# EAGLE schematic parte de carga (EAGLE 9.6.2)
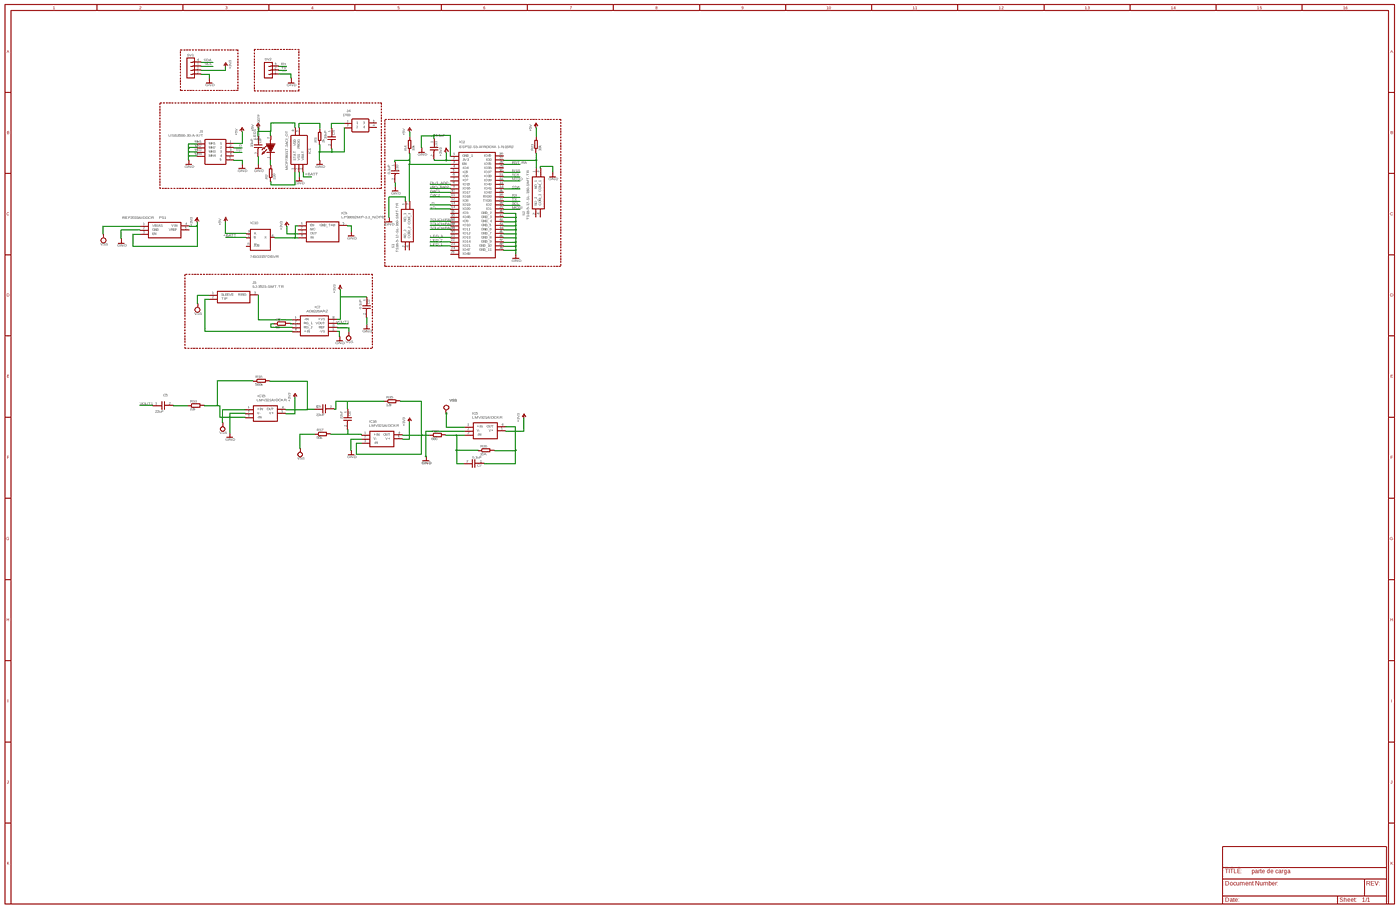
[diagram p0: schematic, sheet 1, overview]
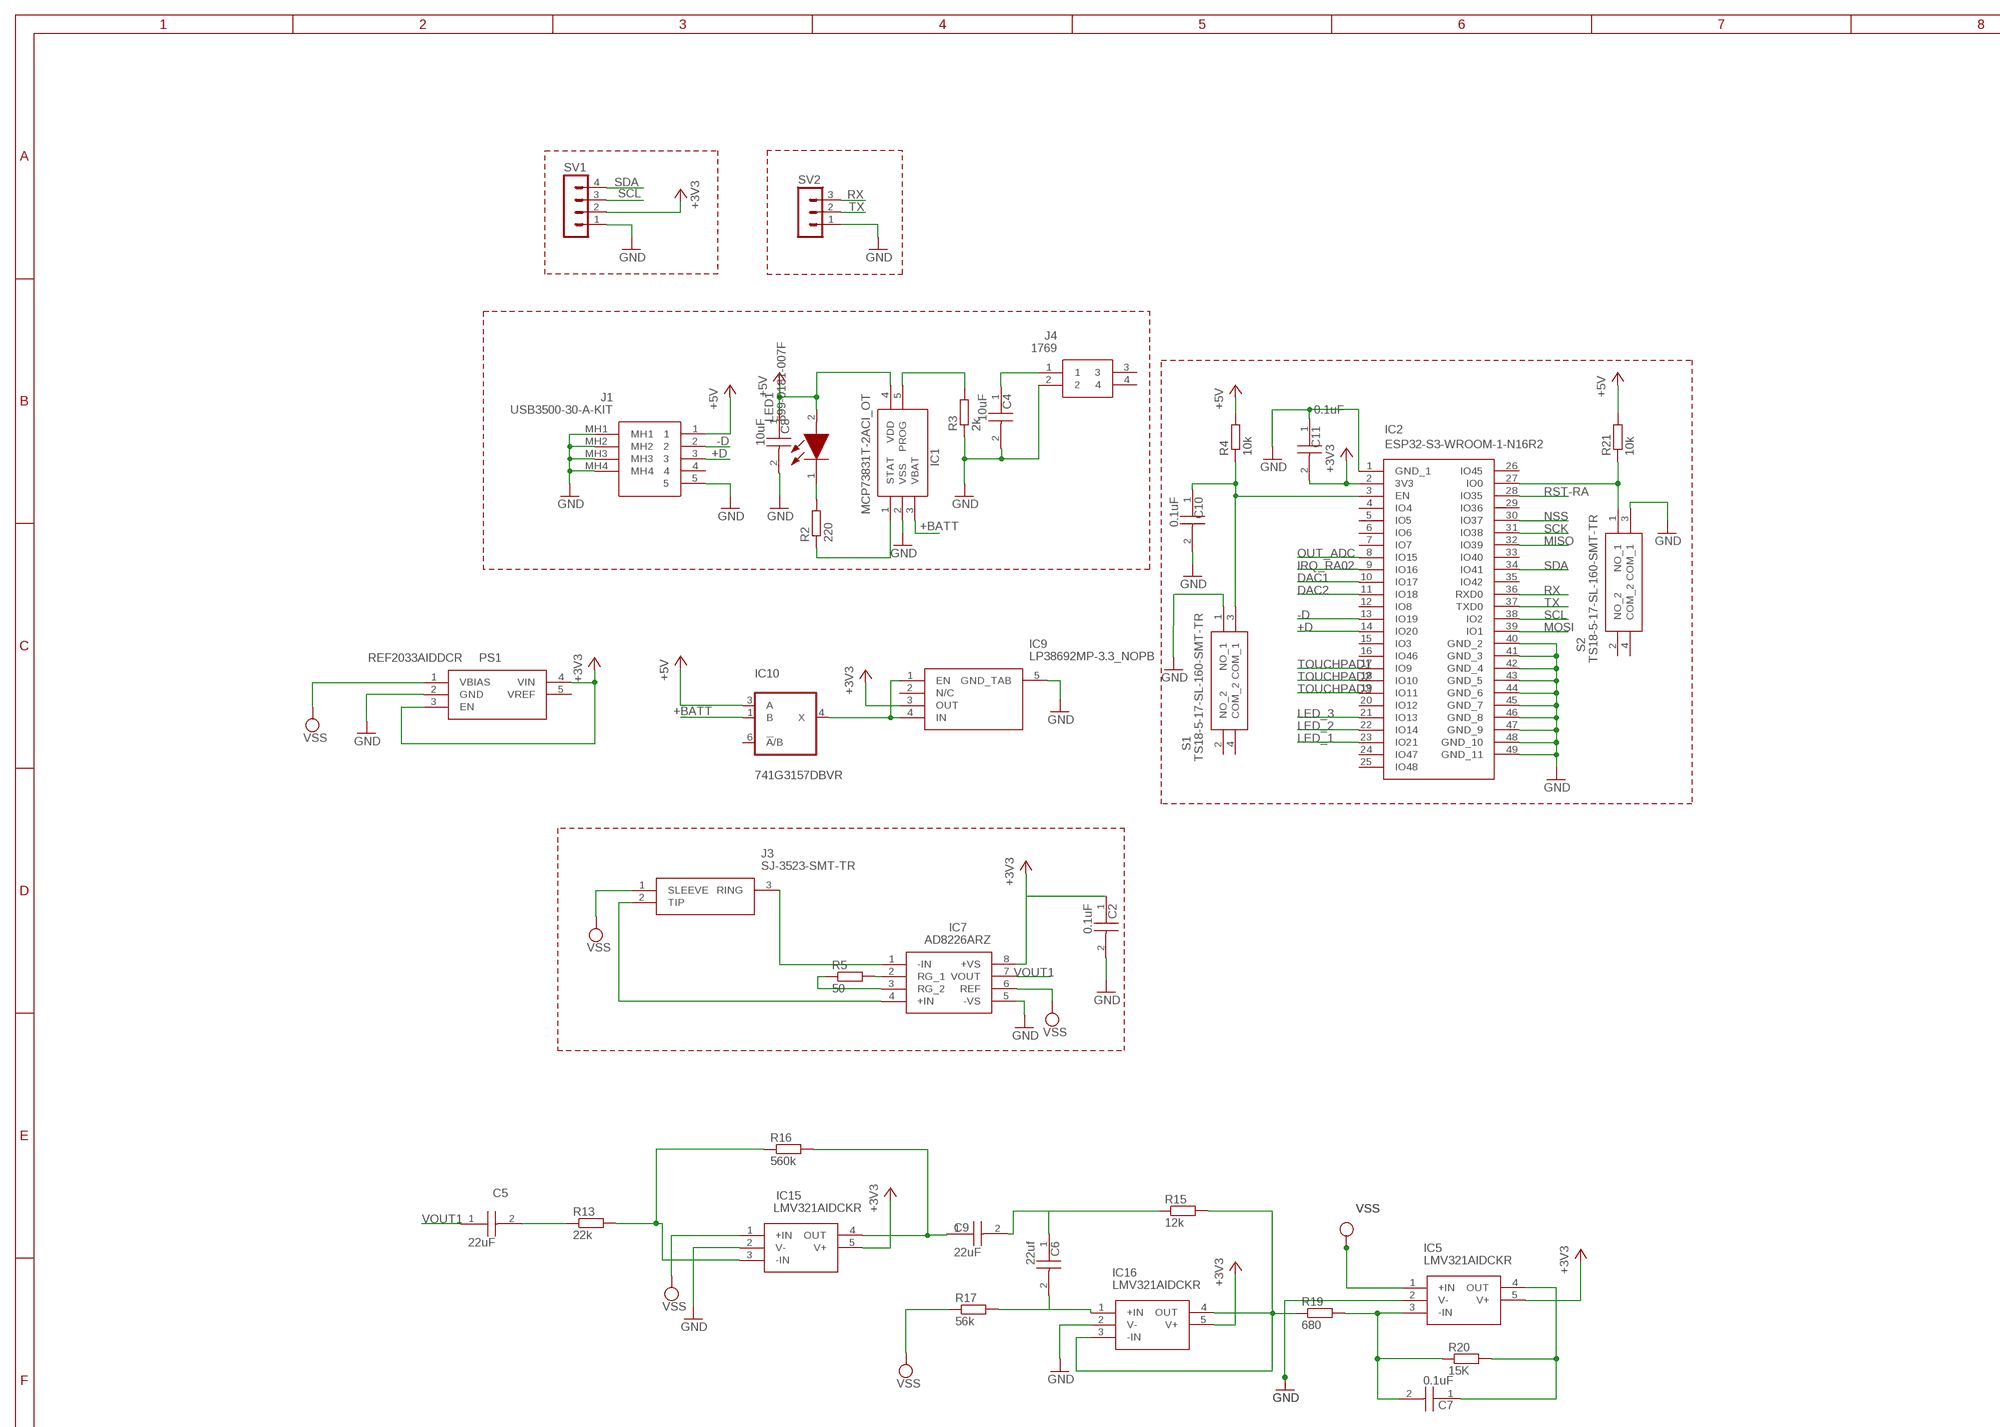
[diagram p1: schematic, sheet 1, part 1 of 4]
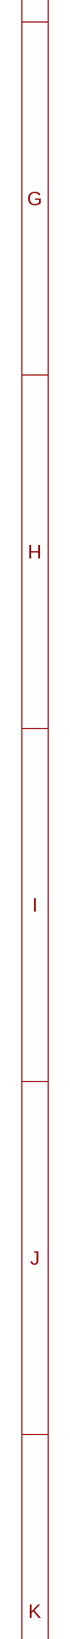
[diagram p2: schematic, sheet 1, part 2 of 4]
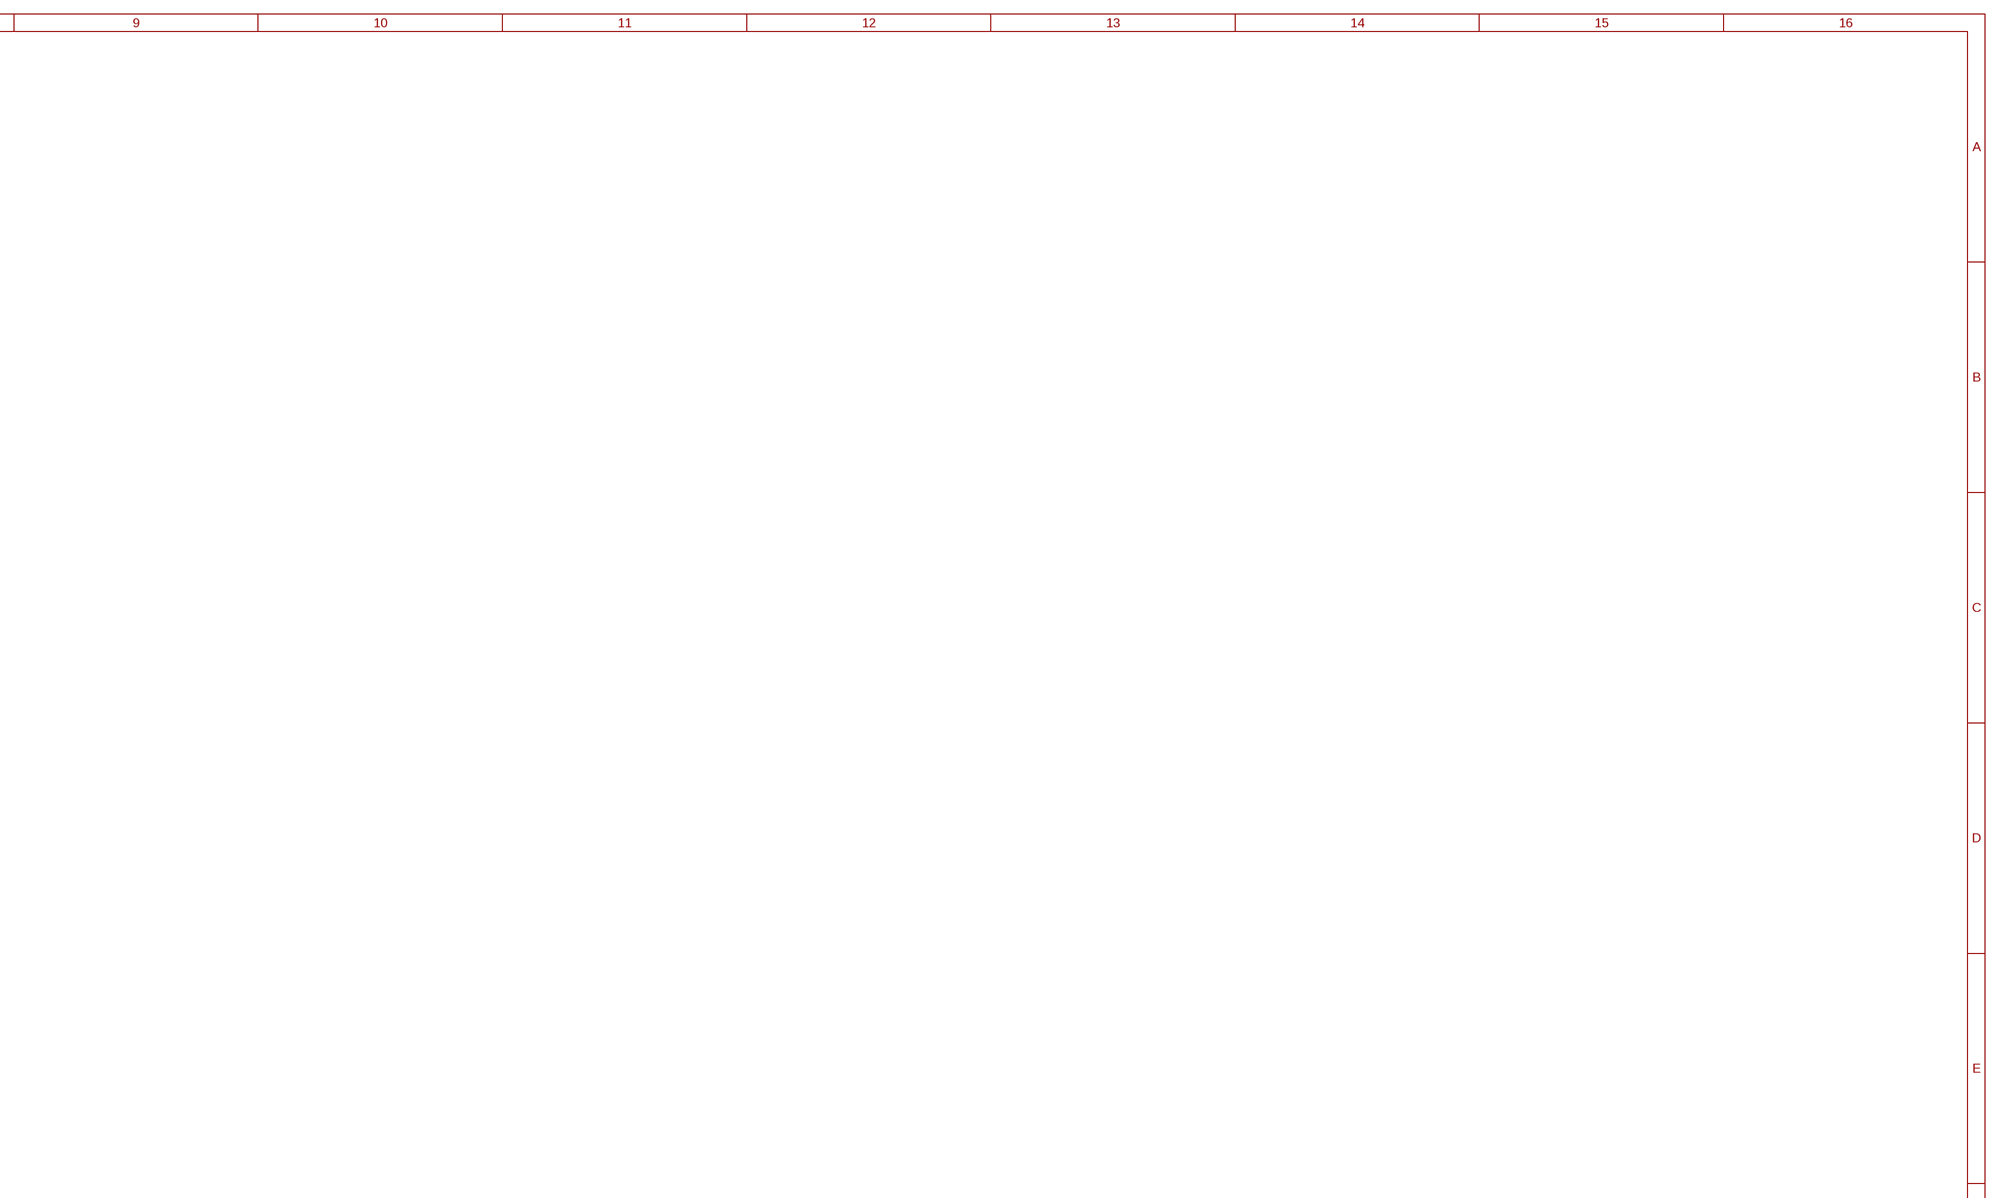
[diagram p3: schematic, sheet 1, part 3 of 4]
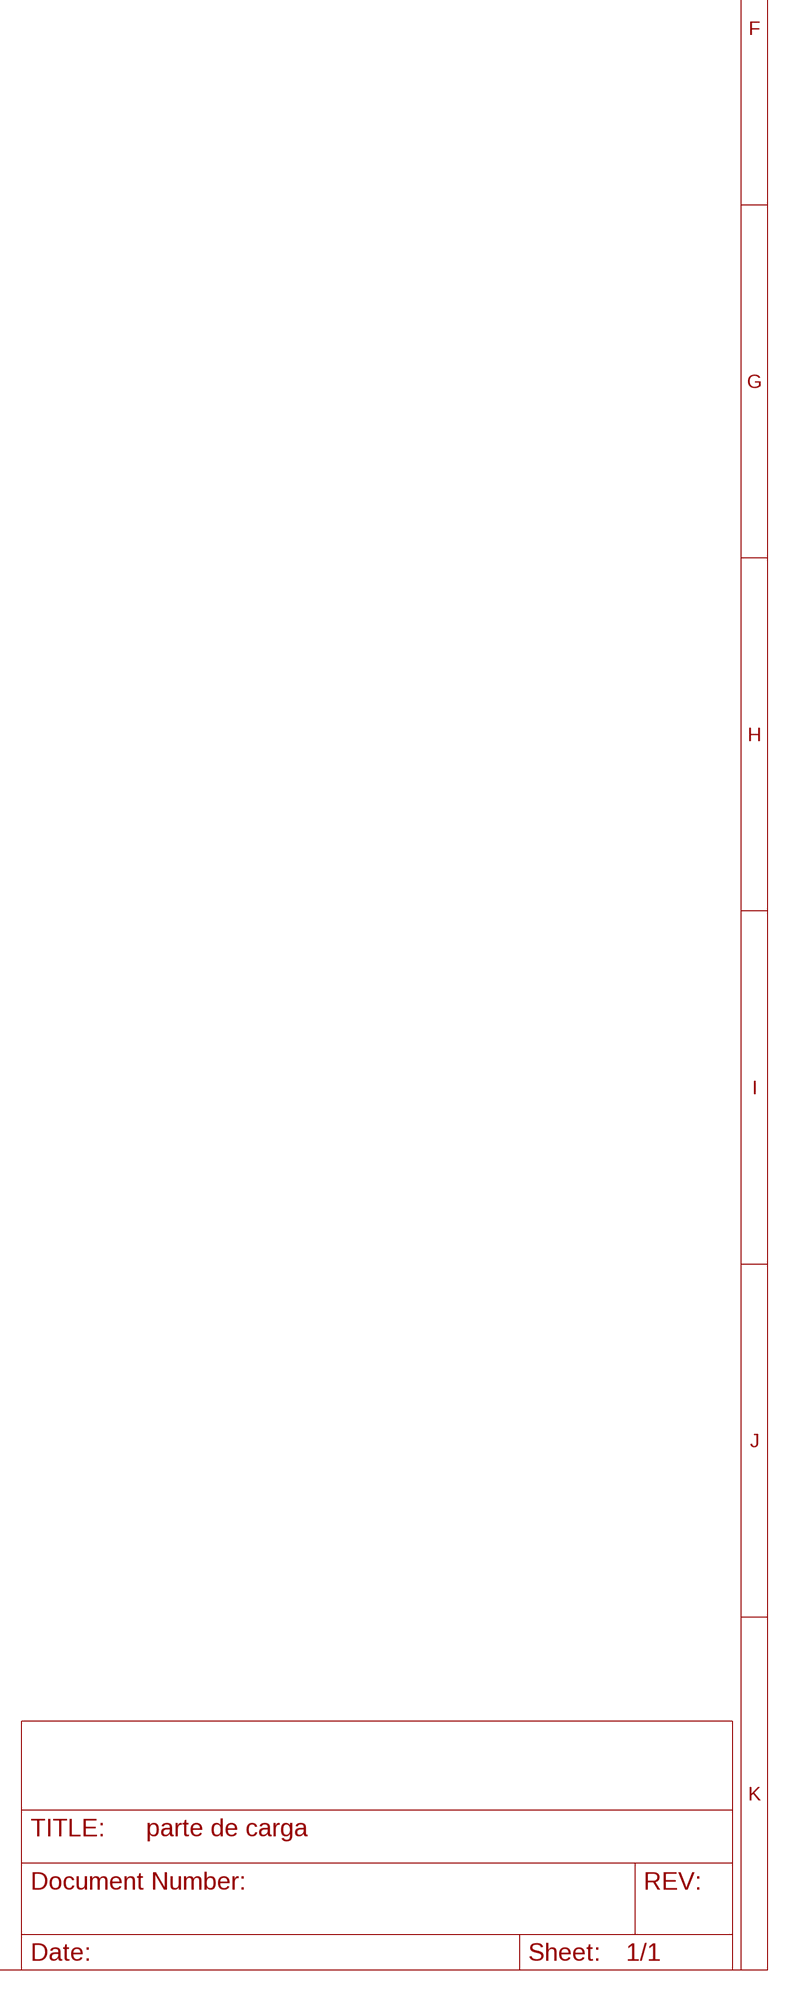
[diagram p4: schematic, sheet 1, part 4 of 4]

## Parts
C2  0.1uF  GCM21B5C2A393JE02L  [CAPC2012X140N]
C4  10uF  GCM21B5C2A393JE02L  [CAPC2012X140N]
C5  22uF  GCM21B5C2A393JE02L  [CAPC2012X140N]
C6  22uf  GCM21B5C2A393JE02L  [CAPC2012X140N]
C7  0.1uF  GCM21B5C2A393JE02L  [CAPC2012X140N]
C8  10uF  GCM21B5C2A393JE02L  [CAPC2012X140N]
C9  22uF  GCM21B5C2A393JE02L  [CAPC2012X140N]
C10  0.1uF  GCM21B5C2A393JE02L  [CAPC2012X140N]
C11  0.1uF  GCM21B5C2A393JE02L  [CAPC2012X140N]
IC1  MCP73831T-2ACI_OT  [SOT95P270X145-5N]
IC2  ESP32-S3-WROOM-1-N16R2  [ESP32S3WROOM1N16R2]
IC5  LMV321AIDCKR  [SOT65P210X110-5N]
IC7  AD8226ARZ  [SOIC127P600X175-8N]
IC9  LP38692MP-3.3_NOPB  [SOT150P700X180-5N]
IC10  741G3157DBVR  [DBV_R-PDSO-G6]
IC15  LMV321AIDCKR  [SOT65P210X110-5N]
IC16  LMV321AIDCKR  [SOT65P210X110-5N]
J1  USB3500-30-A-KIT  [USB350030AKIT]
J3  SJ-3523-SMT-TR  [SJ3523SMTTR]
J4  1769  [1769]
LED1  599-0181-007F  [LEDC2012X70N]
PS1  REF2033AIDDCR  [SOT95P280X110-5N]
R2  220  R-EU_R0805  [R0805]
R3  2k  R-EU_R0805  [R0805]
R4  10k  R-EU_R0805  [R0805]
R5  50  R-EU_R0805  [R0805]
R13  22k  R-EU_R0805  [R0805]
R15  12k  R-EU_R0805  [R0805]
R16  560k  R-EU_R0805  [R0805]
R17  56k  R-EU_R0805  [R0805]
R19  680  R-EU_R0805  [R0805]
R20  15K  R-EU_R0805  [R0805]
R21  10k  R-EU_R0805  [R0805]
S1  TS18-5-17-SL-160-SMT-TR  [TS18517SL160SMTTR]
S2  TS18-5-17-SL-160-SMT-TR  [TS18517SL160SMTTR]
SV1  MA04-1  [MA04-1]
SV2  MA03-1  [MA03-1]

## Nets
+3V3: C2.1 C11.2 IC2.2(3V3) IC5.5(V+) IC7.8(+VS) IC9.3(OUT) IC15.5(V+) IC16.5(V+) PS1.3(EN) PS1.4(VIN) SV1.2
+5V: C8.1 IC1.4(VDD) IC10.3(A) J1.1 LED1.2(A) R4.2 R21.2
+BATT: IC1.3(VBAT)
+D: IC2.14(IO20) J1.3
-D: IC2.13(IO19) J1.2
DAC1: IC2.10(IO17)
DAC2: IC2.11(IO18)
GND: C2.2 C4.2 C8.2 C10.2 C11.1 IC1.2(VSS) IC2.1(GND_1) IC2.40(GND_2) IC2.41(GND_3) IC2.42(GND_4) IC2.43(GND_5) IC2.44(GND_6) IC2.45(GND_7) IC2.46(GND_8) IC2.47(GND_9) IC2.48(GND_10) IC2.49(GND_11) IC5.2(V-) IC7.5(-VS) IC9.5(GND_TAB) IC15.2(V-) IC16.2(V-) J1.5 J1.MH1 J1.MH2 J1.MH3 J1.MH4 J4.2 R3.1 S1.1(NO_1) S2.3(COM_1) SV1.1 SV2.1
IRQ_RA02: IC2.9(IO16)
LED_1: IC2.23(IO21)
LED_2: IC2.22(IO14)
LED_3: IC2.21(IO13)
MISO: IC2.32(IO39)
MOSI: IC2.39(IO1)
N$1: IC1.1(STAT) R2.1
N$2: LED1.1(K) R2.2
N$3: IC1.5(PROG) R3.2
N$4: C10.1 IC2.3(EN) R4.1 S1.3(COM_1)
N$5: IC2.27(IO0) PS1.2(GND) R21.1 S2.1(NO_1) ; supply symbol labelled GND
N$6: IC16.3(-IN) IC16.4(OUT) R15.2 R19.1
N$8: C7.1 IC5.4(OUT) R20.2
N$9: C7.2 IC5.3(-IN) R19.2 R20.1
N$10: IC7.2(RG_1) R5.2
N$11: IC7.1(-IN) J3.3(RING)
N$12: IC7.3(RG_2) R5.1
N$13: C6.2 IC16.1(+IN) R17.2
N$14: C5.2 R13.1
N$15: IC10.1(B)
N$17: IC7.4(+IN) J3.2(TIP)
N$18: C6.1 C9.2 R15.1
N$19: C4.1 J4.1
N$31: IC9.1(EN) IC9.4(IN) IC10.4(X)
N$46: IC15.3(-IN) R13.2 R16.1
N$47: C9.1 IC15.4(OUT) R16.2
NSS: IC2.30(IO37)
OUT_ADC: IC2.8(IO15)
RST-RA: IC2.28(IO35)
RX: IC2.36(RXD0) SV2.3
SCK: IC2.31(IO38)
SCL: IC2.38(IO2) SV1.3
SDA: IC2.34(IO41) SV1.4
TOUCHPAD1: IC2.17(IO9)
TOUCHPAD2: IC2.18(IO10)
TOUCHPAD3: IC2.19(IO11)
TX: IC2.37(TXD0) SV2.2
VOUT1: C5.1 IC7.7(VOUT)
VSS: IC5.1(+IN) IC7.6(REF) IC15.1(+IN) J3.1(SLEEVE) PS1.1(VBIAS) R17.1
Unconnected: IC2.4(IO4) IC2.5(IO5) IC2.6(IO6) IC2.7(IO7) IC2.12(IO8) IC2.15(IO3) IC2.16(IO46) IC2.20(IO12) IC2.24(IO47) IC2.25(IO48) IC2.26(IO45) IC2.29(IO36) IC2.33(IO40) IC2.35(IO42) IC9.2(N/C) IC10.6(!A!/B) J1.4 J4.3 J4.4 PS1.5(VREF) S1.2(NO_2) S1.4(COM_2) S2.2(NO_2) S2.4(COM_2)

## Power pins joined to a net without a drawn wire
GND: IC10.2(GND)
VCC: IC10.5(VCC)

## Library data of the parts
C2 C4-C11 = GCM21B5C2A393JE02L:GCM21B5C2A393JE02L: This specification is applied to Chip Multilayer Ceramic Capacitors. 1.Specific applications: Automotive Powertrain/Safety Equipment: Products that can be used for automotive equipment related to running, turning, stopping, safety devices, etc., or equipment whose structure, equipment, and performance are legally required to meet technical standards for safety assurance or environmental protection. Automotive Infotainment/Comfort Equipment: Products that can be used for automotive equipment such as c Source: Datasheet <https://search.murata.co.jp/Ceramy/image/img/A01X/G101/ENG/GCM21B5C2A393JE02-01A.pdf>; DESCRIPTION: This specification is applied to Chip Multilayer Ceramic Capacitors. 1.Specific applications: Automotive Powertrain/Safety Equipment: Products that can be used for automotive equipment related to running, turning, stopping, safety devices, etc., or equipment whose structure, equipment, and performance are legally required to meet technical standards for safety assurance or environmental protection. Automotive Infotainment/Comfort Equipment: Products that can be used for automotive equipment such as c; HEIGHT: 1.4mm; MANUFACTURER_NAME: Murata Electronics; MANUFACTURER_PART_NUMBER: GCM21B5C2A393JE02L; MOUSER_PART_NUMBER: 81-GCM21B5C2A393JE2L; MOUSER_PRICE-STOCK: https://www.mouser.co.uk/ProductDetail/Murata-Electronics/GCM21B5C2A393JE02L?qs=efUn273yAheACf9Thh026A%3D%3D
IC1 = MCP73831T-2ACI_OT:MCP73831T-2ACI_OT: Li-Ion Charge Controller 4.2V SOT23-5 Source: Datasheet <http://ww1.microchip.com/downloads/en/DeviceDoc/20001984g.pdf>; DESCRIPTION: Li-Ion Charge Controller 4.2V SOT23-5; HEIGHT: 1.45mm; MANUFACTURER_NAME: Microchip; MANUFACTURER_PART_NUMBER: MCP73831T-2ACI/OT; MOUSER_PART_NUMBER: 579-MCP73831T-2ACIOT; MOUSER_PRICE-STOCK: https://www.mouser.co.uk/ProductDetail/Microchip-Technology/MCP73831T-2ACI-OT?qs=yUQqVecv4qvbBQBGbHx0Mw%3D%3D
IC2 = ESP32-S3-WROOM-1-N16R2:ESP32-S3-WROOM-1-N16R2: Bluetooth, WiFi 802.11b/g/n, Bluetooth v5.0 Transceiver Module 2.4GHz PCB Trace Surface Mount , 3V ~ 3.6V , 95mA ~ 97mA , -40C ~ 85C (TA) Source: Datasheet <https://www.espressif.com/sites/default/files/documentation/esp32-s3-wroom-1_wroom-1u_datasheet_en.pdf>; DESCRIPTION: Bluetooth, WiFi 802.11b/g/n, Bluetooth v5.0 Transceiver Module 2.4GHz PCB Trace Surface Mount , 3V ~ 3.6V , 95mA ~ 97mA , -40C ~ 85C (TA); HEIGHT: 3.25mm; MANUFACTURER_NAME: Espressif Systems; MANUFACTURER_PART_NUMBER: ESP32-S3-WROOM-1-N16R2; MOUSER_PART_NUMBER: 356-ESP32S3WRM1N16R2; MOUSER_PRICE-STOCK: https://www.mouser.co.uk/ProductDetail/Espressif-Systems/ESP32-S3-WROOM-1-N16R2?qs=Li%252BoUPsLEnvy1bxV65eH%2Fw%3D%3D
IC5 IC15 IC16 = LMV321AIDCKR:LMV321AIDCKR: Single Low-Voltage, Cost-Optimized Rail-to-Rail Output Operational Amplifier Source: Datasheet <http://www.ti.com/lit/gpn/LMV321A>; DESCRIPTION: Single Low-Voltage, Cost-Optimized Rail-to-Rail Output Operational Amplifier; HEIGHT: 1.1mm; MANUFACTURER_NAME: Texas Instruments; MANUFACTURER_PART_NUMBER: LMV321AIDCKR; MOUSER_PART_NUMBER: 595-LMV321AIDCKR; MOUSER_PRICE-STOCK: https://www.mouser.co.uk/ProductDetail/Texas-Instruments/LMV321AIDCKR?qs=%252BEew9%252B0nqrDxZ%2F4fDfzAtQ%3D%3D
IC7 = AD8226ARZ:AD8226ARZ: Wide Supply Range, Rail-to-Rail Output Instrumentation Amplifier Source: Datasheet <http://componentsearchengine.com/Datasheets/3/AD8226ARZ.pdf>; DESCRIPTION: Wide Supply Range, Rail-to-Rail Output Instrumentation Amplifier; HEIGHT: 1.75mm; MANUFACTURER_NAME: Analog Devices; MANUFACTURER_PART_NUMBER: AD8226ARZ; MOUSER_PART_NUMBER: 584-AD8226ARZ; MOUSER_PRICE-STOCK: https://www.mouser.co.uk/ProductDetail/Analog-Devices/AD8226ARZ?qs=%2FtpEQrCGXCzihJADRPlhCg%3D%3D
IC9 = LP38692MP-3.3_NOPB:LP38692MP-3.3_NOPB: LP38692MP-3.3/NOPB, Low Dropout Voltage Regulator, 1A, 3.3 V +/-2.5%, 2.7 10 Vin, 5-Pin SOT-223 Source: Datasheet <http://www.ti.com/lit/ds/symlink/lp38692.pdf>; DESCRIPTION: LP38692MP-3.3/NOPB, Low Dropout Voltage Regulator, 1A, 3.3 V +/-2.5%, 2.7 10 Vin, 5-Pin SOT-223; HEIGHT: 1.8mm; MANUFACTURER_NAME: Texas Instruments; MANUFACTURER_PART_NUMBER: LP38692MP-3.3/NOPB; MOUSER_PART_NUMBER: 926-LP38692MP3.3NOPB; MOUSER_PRICE-STOCK: https://www.mouser.co.uk/ProductDetail/Texas-Instruments/LP38692MP-3.3-NOPB?qs=1FNqv8aZn1TpKuOP2NKBdg%3D%3D
IC10 = 74xx-little-us:74*1G3157: Single-Pole, Double-Throw Analog Switch Source: http://focus.ti.com/lit/ds/symlink/sn74lvc1g3157.pdf
J1 = USB3500-30-A-KIT:USB3500-30-A-KIT: USB Connectors Micro B Skt, Mid Mount-SMT, R/A, 30u", With Peg, T&R, IP67 + USBTJ-02 Gasket Source: Datasheet <https://gct.co/files/drawings/usb3500.pdf>; DESCRIPTION: USB Connectors Micro B Skt, Mid Mount-SMT, R/A, 30u", With Peg, T&R, IP67 + USBTJ-02 Gasket; HEIGHT: 2.8mm; MANUFACTURER_NAME: GCT (GLOBAL CONNECTOR TECHNOLOGY); MANUFACTURER_PART_NUMBER: USB3500-30-A-KIT; MOUSER_PART_NUMBER: 640-USB3500-30-A-KIT; MOUSER_PRICE-STOCK: https://www.mouser.co.uk/ProductDetail/GCT/USB3500-30-A-KIT?qs=KUoIvG%2F9IlZmD2kH2DfgYg%3D%3D
J3 = SJ-3523-SMT-TR:SJ-3523-SMT-TR: 3.5 mm, Stereo, Right Angle, Surface Mount (SMT), 3 Conductors, 0 Internal Switches, Audio Jack Connector Source: Datasheet <https://www.sameskydevices.com/product/resource/supplyframepdf/sj-352x-smt.pdf>; DESCRIPTION: 3.5 mm, Stereo, Right Angle, Surface Mount (SMT), 3 Conductors, 0 Internal Switches, Audio Jack Connector; HEIGHT: 5.2mm; MANUFACTURER_NAME: Same Sky; MANUFACTURER_PART_NUMBER: SJ-3523-SMT-TR; MOUSER_PART_NUMBER: 490-SJ-3523-SMT-TR; MOUSER_PRICE-STOCK: https://www.mouser.co.uk/ProductDetail/CUI-Devices/SJ-3523-SMT-TR?qs=WyjlAZoYn51zOHzJ3r4ZRA%3D%3D
J4 = 1769:1769: Adafruit Accessories JST-PH 2-pin SMT Right Angle Connect Source: Datasheet <https://cdn-shop.adafruit.com/datasheets/17311.pdf>; ARROW_PART_NUMBER: 1769; ARROW_PRICE-STOCK: https://www.arrow.com/en/products/1769/adafruit-industries?utm_currency=USD&region=nac; DESCRIPTION: Adafruit Accessories JST-PH 2-pin SMT Right Angle Connect; HEIGHT: 5.5mm; MANUFACTURER_NAME: Adafruit; MANUFACTURER_PART_NUMBER: 1769; MOUSER_PART_NUMBER: 485-1769; MOUSER_PRICE-STOCK: https://www.mouser.co.uk/ProductDetail/Adafruit/1769?qs=GURawfaeGuBbgoGtf2XstA%3D%3D
LED1 = 599-0181-007F:599-0181-007F: Standard LEDs - SMD SMD 0805 GREEN Source: Datasheet; DESCRIPTION: Standard LEDs - SMD SMD 0805 GREEN; HEIGHT: 0.7mm; MANUFACTURER_NAME: Dialight; MANUFACTURER_PART_NUMBER: 599-0181-007F; MOUSER_PART_NUMBER: 645-599-0181-007F; MOUSER_PRICE-STOCK: https://www.mouser.co.uk/ProductDetail/Dialight/599-0181-007F?qs=gTYE2QTfZfRUSax8JbgA2w%3D%3D
PS1 = REF2033AIDDCR:REF2033AIDDCR: Low-Drift, Low-Power, Dual-Output Vref and Vref/2 Voltage Reference Source: Datasheet <http://www.ti.com/lit/ds/symlink/ref2033.pdf>; DESCRIPTION: Low-Drift, Low-Power, Dual-Output Vref and Vref/2 Voltage Reference; HEIGHT: 1.1mm; MANUFACTURER_NAME: Texas Instruments; MANUFACTURER_PART_NUMBER: REF2033AIDDCR; MOUSER_PART_NUMBER: 595-REF2033AIDDCR; MOUSER_PRICE-STOCK: https://www.mouser.co.uk/ProductDetail/Texas-Instruments/REF2033AIDDCR?qs=7z%252BmIopC6%2FKHHOBVNaL7UQ%3D%3D
R2-R5 R13 R15-R17 R19-R21 = rcl:R-EU_: RESISTOR, European symbol; SPICEPREFIX: R
S1 = TS18-5-17-SL-160-SMT-TR:TS18-5-17-SL-160-SMT-TR: 5 x 5 mm, 1.7 mm Actuator Height, 160 gf, Silver, Surface Mount, TR, SPST, Tactile Switch Source: Datasheet <https://www.sameskydevices.com/product/resource/supplyframepdf/ts18.pdf>; DESCRIPTION: 5 x 5 mm, 1.7 mm Actuator Height, 160 gf, Silver, Surface Mount, TR, SPST, Tactile Switch; HEIGHT: 1.8mm; MANUFACTURER_NAME: Same Sky; MANUFACTURER_PART_NUMBER: TS18-5-17-SL-160-SMT-TR; MOUSER_PART_NUMBER: 179-TS18517SL160SMTT; MOUSER_PRICE-STOCK: https://www.mouser.co.uk/ProductDetail/CUI-Devices/TS18-5-17-SL-160-SMT-TR?qs=tlsG%2FOw5FFhWy38y3t272A%3D%3D
S2 = TS18-5-17-SL-160-SMT-TR:TS18-5-17-SL-160-SMT-TR: 5 x 5 mm, 1.7 mm Actuator Height, 160 gf, Silver, Surface Mount, TR, SPST, Tactile Switch Source: Datasheet <https://www.sameskydevices.com/product/resource/supplyframepdf/ts18.pdf>; DESCRIPTION: FLASH; HEIGHT: 1.8mm; MANUFACTURER_NAME: Same Sky; MANUFACTURER_PART_NUMBER: TS18-5-17-SL-160-SMT-TR; MOUSER_PART_NUMBER: 179-TS18517SL160SMTT; MOUSER_PRICE-STOCK: https://www.mouser.co.uk/ProductDetail/CUI-Devices/TS18-5-17-SL-160-SMT-TR?qs=tlsG%2FOw5FFhWy38y3t272A%3D%3D
SV1 = con-lstb:MA04-1: PIN HEADER; OC_FARNELL: unknown; OC_NEWARK: unknown
SV2 = con-lstb:MA03-1: PIN HEADER; OC_FARNELL: unknown; OC_NEWARK: unknown